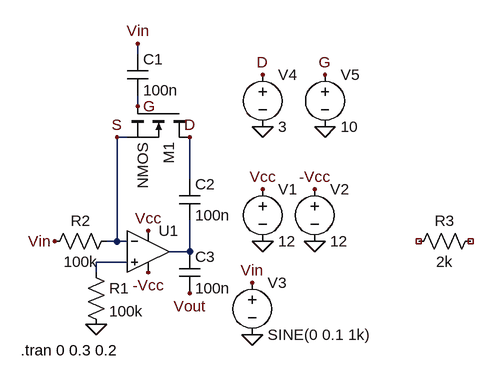
[diagram p0: schematic agc_deneme.asc]
agc_deneme.asc, the LTspice schematic file:
Version 4
SHEET 1 880 680
WIRE 144 -144 144 -160
WIRE 144 -64 144 -80
WIRE 128 -16 112 -16
WIRE 224 48 224 -16
WIRE 112 144 112 -16
WIRE 112 144 96 144
WIRE 128 144 112 144
WIRE 224 160 224 112
WIRE 224 160 192 160
WIRE 128 176 80 176
WIRE 80 192 80 176
FLAG 80 272 0
FLAG 416 144 0
FLAG 336 144 0
FLAG 336 64 Vcc
FLAG 160 128 Vcc
FLAG 416 64 -Vcc
FLAG 160 192 -Vcc
FLAG 16 144 Vin
FLAG 224 224 Vout
FLAG 320 288 0
FLAG 320 208 Vin
FLAG 224 -16 D
FLAG 112 -16 S
FLAG 144 -160 Vin
FLAG 144 -64 G
FLAG 336 -32 0
FLAG 432 -32 0
FLAG 336 -112 D
FLAG 432 -112 G
SYMBOL OpAmps\\UniversalOpAmp 160 160 R0
SYMATTR InstName U1
SYMBOL res 64 176 R0
SYMATTR InstName R1
SYMATTR Value 100k
SYMBOL res 112 128 R90
WINDOW 0 0 56 VBottom 2
WINDOW 3 32 56 VTop 2
SYMATTR InstName R2
SYMATTR Value 100k
SYMBOL voltage 336 48 R0
WINDOW 123 0 0 Left 0
WINDOW 39 0 0 Left 0
SYMATTR InstName V1
SYMATTR Value 12
SYMBOL voltage 416 48 R0
WINDOW 123 0 0 Left 0
WINDOW 39 0 0 Left 0
SYMATTR InstName V2
SYMATTR Value 12
SYMBOL res 672 128 R90
WINDOW 0 0 56 VBottom 2
WINDOW 3 32 56 VTop 2
SYMATTR InstName R3
SYMATTR Value 2k
SYMBOL voltage 320 192 R0
WINDOW 123 0 0 Left 0
WINDOW 39 0 0 Left 0
SYMATTR InstName V3
SYMATTR Value SINE(0 0.1 1k)
SYMBOL nmos 224 -64 R90
SYMATTR InstName M1
SYMBOL cap 128 -144 R0
SYMATTR InstName C1
SYMATTR Value 100n
SYMBOL cap 208 48 R0
SYMATTR InstName C2
SYMATTR Value 100n
SYMBOL voltage 336 -128 R0
WINDOW 123 0 0 Left 0
WINDOW 39 0 0 Left 0
SYMATTR InstName V4
SYMATTR Value 3
SYMBOL voltage 432 -128 R0
WINDOW 123 0 0 Left 0
WINDOW 39 0 0 Left 0
SYMATTR InstName V5
SYMATTR Value 10
SYMBOL cap 208 160 R0
SYMATTR InstName C3
SYMATTR Value 100n
TEXT -36 312 Left 2 !.tran 0 0.3 0.2

The netlist it stands for:
* agc_deneme.asc
XU1 N002 S Vcc -Vcc N001 level1 Avol=1Meg GBW=10Meg Vos=0 En=0 Enk=0 In=0 Ink=0 Rin=500Meg  ; pins In+ In- V+ V- OUT
R1 N002 0 100k
R2 S Vin 100k
V1 Vcc 0 12
V2 -Vcc 0 12
R3 NC_01 NC_02 2k
V3 Vin 0 SINE(0 0.1 1k)
M1 D G S S NMOS
C1 Vin G 100n
C2 D N001 100n
V4 D 0 3
V5 G 0 10
C3 N001 Vout 100n
.model NMOS NMOS
.model PMOS PMOS
.lib standard.mos
.tran 0 0.3 0.2
.lib UniversalOpAmp1.lib
.backanno
.end